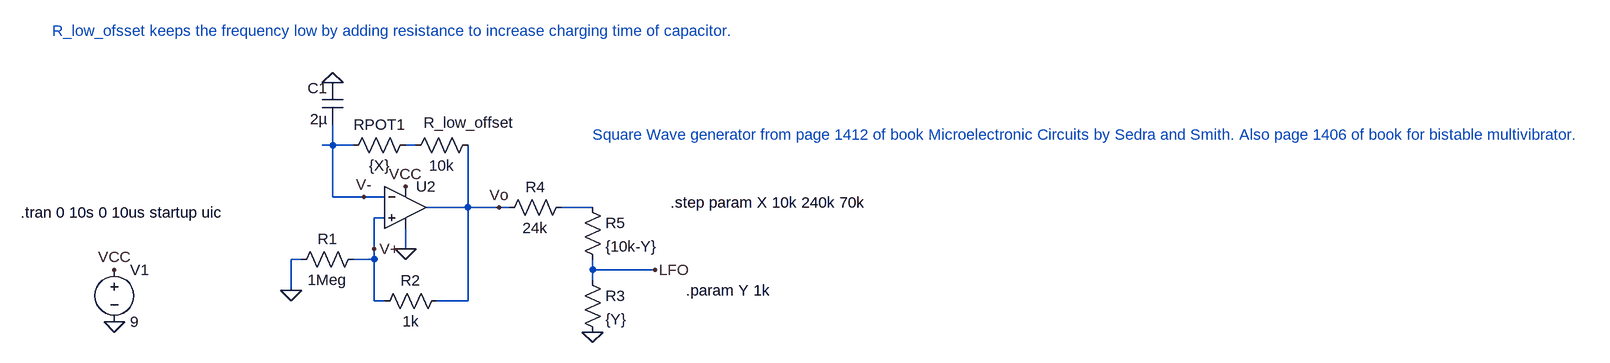
[diagram p0: schematic LFO-square.asc]
LFO-square.asc, the LTspice schematic file:
Version 4
SHEET 1 5224 1764
WIRE 2752 16 2752 -16
WIRE 2752 16 2736 16
WIRE 2784 16 2752 16
WIRE 2880 16 2864 16
WIRE 2752 96 2752 16
WIRE 2800 96 2752 96
WIRE 2832 96 2800 96
WIRE 2960 112 2960 16
WIRE 2960 112 2896 112
WIRE 3008 112 2960 112
WIRE 3024 112 3008 112
WIRE 3152 112 3104 112
WIRE 2832 128 2816 128
WIRE 2816 176 2816 128
WIRE 2864 176 2864 144
WIRE 2704 192 2688 192
WIRE 2816 192 2816 176
WIRE 2816 192 2784 192
WIRE 3152 208 3152 192
WIRE 3248 208 3152 208
WIRE 3152 224 3152 208
WIRE 2688 240 2688 192
WIRE 2816 256 2816 192
WIRE 2832 256 2816 256
WIRE 2960 256 2960 112
WIRE 2960 256 2912 256
FLAG 2864 80 VCC
FLAG 2864 176 0
FLAG 2752 -80 0
FLAG 2688 240 0
FLAG 3008 112 Vo
FLAG 2800 96 V-
FLAG 2816 176 V+
FLAG 2416 288 0
FLAG 2416 208 VCC
FLAG 3248 208 LFO
FLAG 3152 304 0
SYMBOL Opamps\\UniversalOpamp2 2864 112 R0
SYMATTR InstName U2
SYMBOL res 2800 176 R90
WINDOW 0 0 56 VBottom 2
WINDOW 3 32 56 VTop 2
SYMATTR InstName R1
SYMATTR Value 1Meg
SYMBOL res 2928 240 R90
WINDOW 0 0 56 VBottom 2
WINDOW 3 32 56 VTop 2
SYMATTR InstName R2
SYMATTR Value 1k
SYMBOL res 2880 0 R90
WINDOW 0 0 56 VBottom 2
WINDOW 3 32 56 VTop 2
SYMATTR InstName RPOT1
SYMATTR Value {X}
SYMBOL cap 2768 -16 R180
WINDOW 0 24 56 Left 2
WINDOW 3 24 8 Left 2
SYMATTR InstName C1
SYMATTR Value 2µ
SYMBOL voltage 2416 192 R0
WINDOW 123 0 0 Left 0
WINDOW 39 0 0 Left 0
SYMATTR InstName V1
SYMATTR Value 9
SYMBOL res 3120 96 R90
WINDOW 0 0 56 VBottom 2
WINDOW 3 32 56 VTop 2
SYMATTR InstName R4
SYMATTR Value 24k
SYMBOL res 3136 96 R0
SYMATTR InstName R5
SYMATTR Value {10k-Y}
SYMBOL res 2976 0 R90
WINDOW 0 -3 14 VBottom 2
WINDOW 3 32 56 VTop 2
SYMATTR InstName R_low_offset
SYMATTR Value 10k
SYMBOL res 3136 208 R0
SYMATTR InstName R3
SYMATTR Value {Y}
TEXT 2272 120 Left 2 !.tran 0 10s 0 10us startup uic
TEXT 2320 -160 Left 2 ;R_low_ofsset keeps the frequency low by adding resistance to increase charging time of capacitor.
TEXT 3152 0 Left 2 ;Square Wave generator from page 1412 of book Microelectronic Circuits by Sedra and Smith. Also page 1406 of book for bistable multivibrator.
TEXT 3272 104 Left 2 !.step param X 10k 240k 70k
TEXT 3296 240 Left 2 !.param Y 1k

The netlist it stands for:
* LFO-square.asc
XU2 V+ V- VCC 0 Vo level.2 Avol=1Meg GBW=10Meg Slew=10Meg ilimit=25m rail=0 Vos=0 phimargin=45 en=0 enk=0 in=0 ink=0 Rin=500Meg  ; pins IN+ IN- V+ V- OUT
R1 V+ 0 1Meg
R2 Vo V+ 1k
RPOT1 N001 V- {X}
C1 V- 0 2µ
V1 VCC 0 9
R4 N002 Vo 24k
R5 N002 LFO {10k-Y}
R_low_offset Vo N001 10k
R3 LFO 0 {Y}
.tran 0 10s 0 10us startup uic
* R_low_ofsset keeps the frequency low by adding resistance to increase charging time of capacitor.
* Square Wave generator from page 1412 of book Microelectronic Circuits by Sedra and Smith. Also page 1406 of book for bistable multivibrator.
.step param X 10k 240k 70k
.param Y 1k
.lib UniversalOpamps2.sub
.backanno
.end